# EAGLE design Adafruit PCF8575 (EAGLE 9.6.2)
COMPANY: ADAFRUIT INDUSTRIES; DRAWN: KTOWN; REV: A
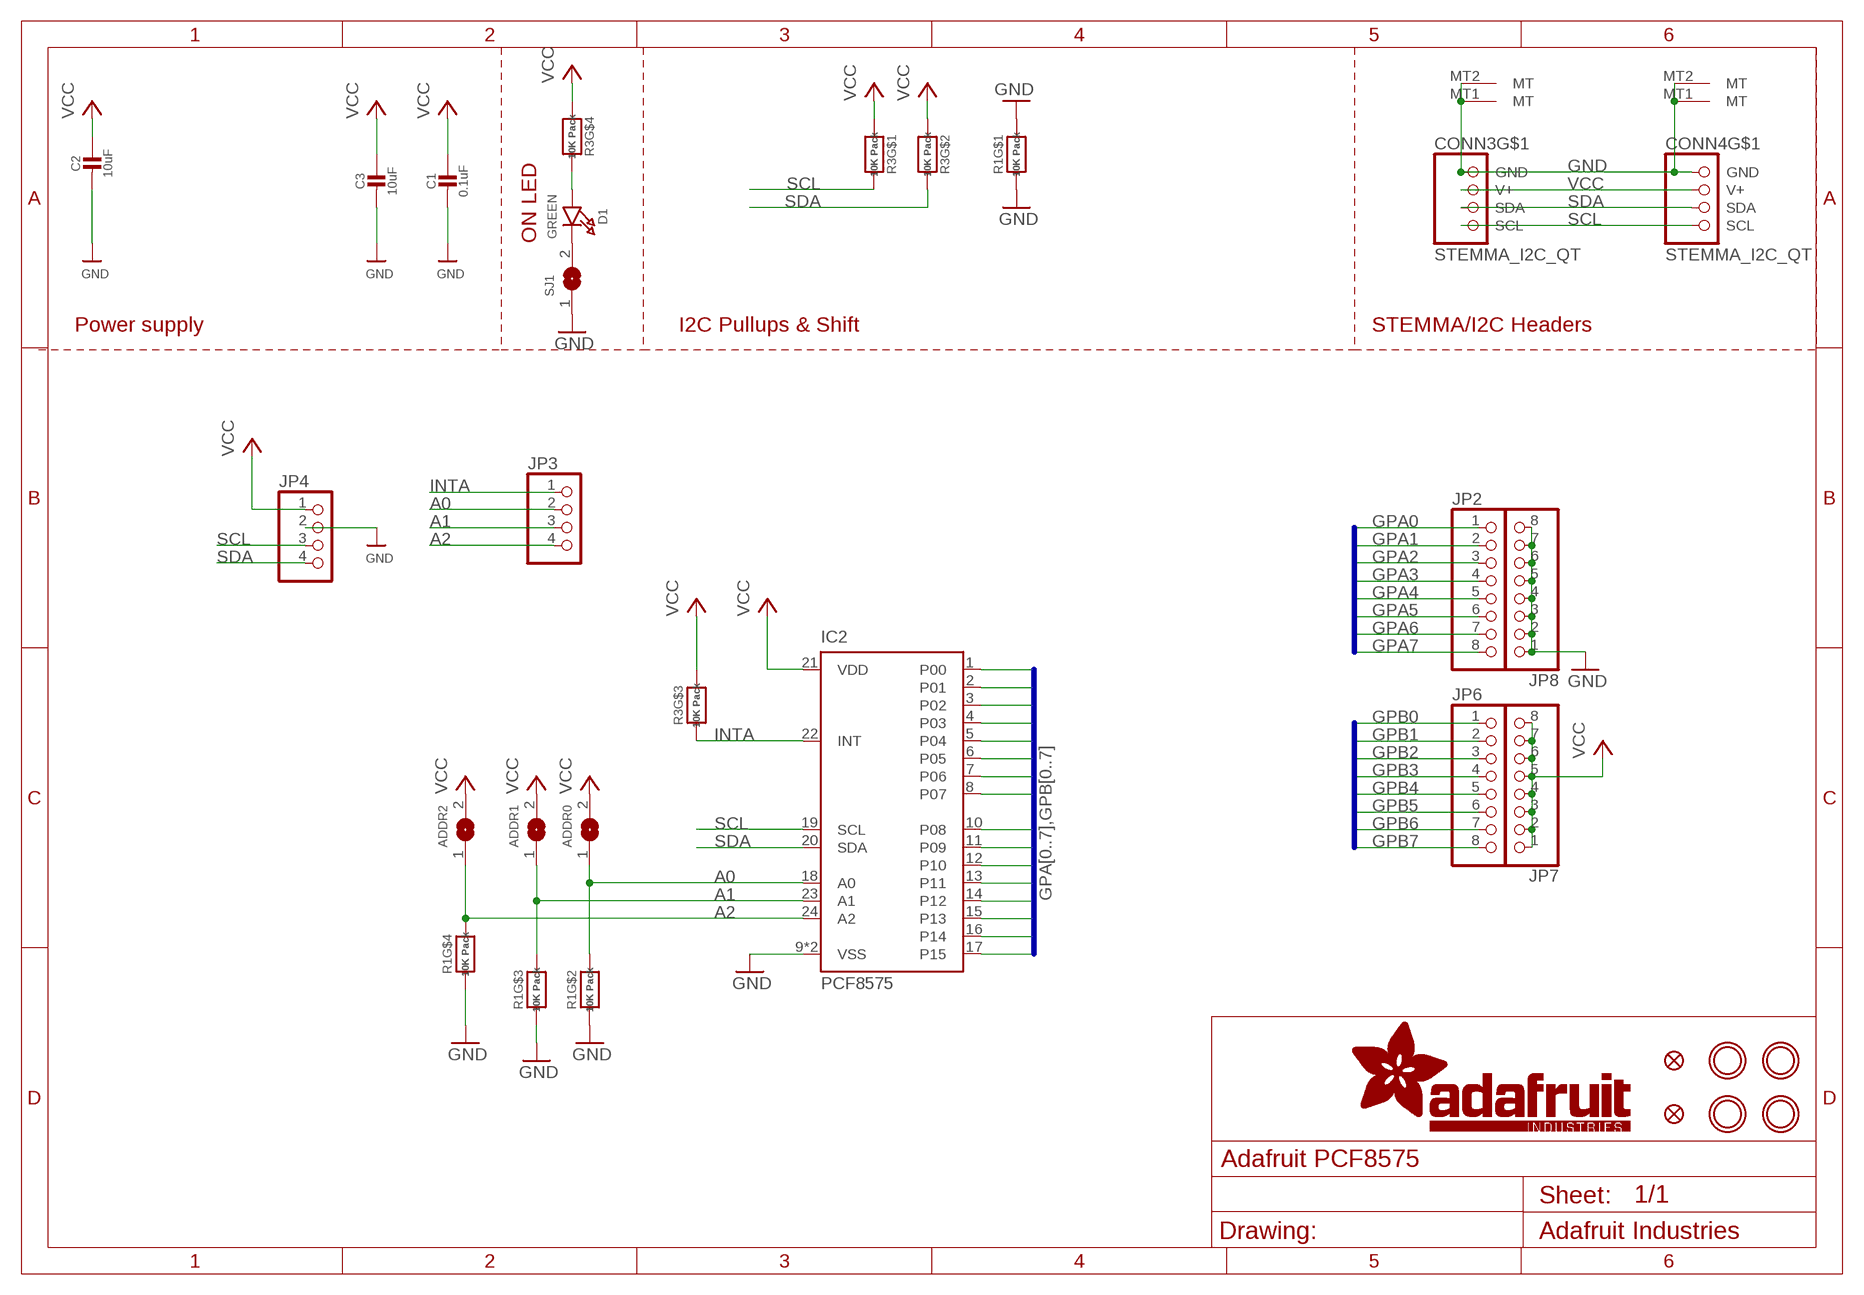
[diagram p0: schematic, sheet 1]

## Parts
ADDR0  SOLDERJUMPER  [SOLDERJUMPER_ARROW_NOPASTE]
ADDR1  SOLDERJUMPER  [SOLDERJUMPER_ARROW_NOPASTE]
ADDR2  SOLDERJUMPER  [SOLDERJUMPER_ARROW_NOPASTE]
C1  0.1uF  CAP_CERAMIC0603_NO  [0603-NO]
C2  10uF  CAP_CERAMIC0805-NOOUTLINE  [0805-NO]
C3  10uF  CAP_CERAMIC0805-NOOUTLINE  [0805-NO]
CONN3  STEMMA_I2C_QT  [JST_SH4]
CONN4  STEMMA_I2C_QT  [JST_SH4]
D1  GREEN  LED0603_NOOUTLINE  [CHIPLED_0603_NOOUTLINE]
FID3  FIDUCIAL_1MM  [FIDUCIAL_1MM]
FID4  FIDUCIAL_1MM  [FIDUCIAL_1MM]
IC2  PCF8575  [QFN24_4MM_SMSC]
JP2  HEADER-1X870MIL  [1X08_ROUND_70]
JP3  HEADER-1X4ROUND  [1X04_ROUND]
JP4  HEADER-1X4ROUND  [1X04_ROUND]
JP6  HEADER-1X870MIL  [1X08_ROUND_70]
JP7  HEADER-1X870MIL  [1X08_ROUND_70]
JP8  HEADER-1X870MIL  [1X08_ROUND_70]
R1  10K Pack  RESISTOR_4PACK  [RESPACK_4X0603]
R3  10K Pack  RESISTOR_4PACK  [RESPACK_4X0603]
SJ1  SOLDERJUMPERCLOSED  [SOLDERJUMPER_CLOSEDWIRE]
U$1  MOUNTINGHOLE2.5  [MOUNTINGHOLE_2.5_PLATED]
U$17  MOUNTINGHOLE2.5  [MOUNTINGHOLE_2.5_PLATED]
U$19  MOUNTINGHOLE2.5  [MOUNTINGHOLE_2.5_PLATED]
U$21  MOUNTINGHOLE2.5  [MOUNTINGHOLE_2.5_PLATED]

## Nets
A0: ADDR0.1 IC2.18(A0) JP3.2 R1.7
A1: ADDR1.1 IC2.23(A1) JP3.3 R1.6
A2: ADDR2.1 IC2.24(A2) JP3.4 R1.5
GND [highpower]: C1.2 C2.2 C3.2 CONN3.1(GND) CONN3.MT1(MT) CONN3.MT2(MT) CONN4.1(GND) CONN4.MT1(MT) CONN4.MT2(MT) IC2.9(VSS) IC2.THERM(VSS) JP4.2 JP8.1 JP8.2 JP8.3 JP8.4 JP8.5 JP8.6 JP8.7 JP8.8 R1.1 R1.2 R1.3 R1.4 R1.8 SJ1.1
GPA0: IC2.1(P00) JP2.1
GPA1: IC2.2(P01) JP2.2
GPA2: IC2.3(P02) JP2.3
GPA3: IC2.4(P03) JP2.4
GPA4: IC2.5(P04) JP2.5
GPA5: IC2.6(P05) JP2.6
GPA6: IC2.7(P06) JP2.7
GPA7: IC2.8(P07) JP2.8
GPB0: IC2.10(P08) JP6.1
GPB1: IC2.11(P09) JP6.2
GPB2: IC2.12(P10) JP6.3
GPB3: IC2.13(P11) JP6.4
GPB4: IC2.14(P12) JP6.5
GPB5: IC2.15(P13) JP6.6
GPB6: IC2.16(P14) JP6.7
GPB7: IC2.17(P15) JP6.8
INTA: IC2.22(INT) JP3.1 R3.3
N$1: D1.A R3.5
N$2 [highpower]: D1.C SJ1.2
SCL: CONN3.4(SCL) CONN4.4(SCL) IC2.19(SCL) JP4.3 R3.8
SDA: CONN3.3(SDA) CONN4.3(SDA) IC2.20(SDA) JP4.4 R3.7
VCC [highpower]: ADDR0.2 ADDR1.2 ADDR2.2 C1.1 C2.1 C3.1 CONN3.2(V+) CONN4.2(V+) IC2.21(VDD) JP4.1 JP7.1 JP7.2 JP7.3 JP7.4 JP7.5 JP7.6 JP7.7 JP7.8 R3.1 R3.2 R3.4 R3.6

## Buses
GPA[0..7],GPB[0..7]

## Notes on the sheet
- ON LED
- Power supply | I2C Pullups & Shift | STEMMA/I2C Headers

## Library data of the parts
ADDR0 ADDR1 ADDR2 = microbuilder:SOLDERJUMPER: SMD Solder JUMPER Solder the two pads together to create a connection, or remove the solder to break it. REFLOW - Use this footprint for solder paste and reflow ovens. WAVE - Use this footprint for hand-soldering (larger pads). CLOSED - Has a trace between the two pads to ensure it is closed by default. The trace needs to be cut to disable the jumper, and can be closed again by creating a solder bridge between the two pads.; BOM: EXCLUDE
C1-C3 = microbuilder:CAP_CERAMIC: Ceramic Capacitors For new designs, use the packages preceded by an '_' character since they are more reliable: The following footprints should be used on most boards: _0402 - Standard footprint for regular board layouts _0603 - Standard footprint for regular board layouts _0805 - Standard footprint for regular board layouts _1206 - Standard footprint for regular board layouts For extremely tight-pitch boards where space is at a premium, the following 'micro-pitch' footprints can be used (smaller pads, no silkscreen outline, etc.): _0402MP - Micro-pitch footprint for very dense/compact boards _0603MP - Micro-pitch footprint for very dense/compact boards _0805MP - Micro-pitch footprint for very dense/compact boards _1206MP - Micro-pitch footprint for very dense/compact boards
CONN3 CONN4 = adafruit_electromech:STEMMA_I2C; LCSC: C2845363
D1 = microbuilder:LED: LED 0603 - 0603 Surface Mount Package 2mA: Green LED - Low Power (3.9mcd, 2ma, 1.7Vf) - Digikey: 475-2709-2-ND Orange LED - Low Power (9.8mcd, 2ma, 1.8Vf) - Digikey: 475-1194-2-ND Red LED - Low Power (5mcd, 2ma, 1.8Vf) - Digikey: 475-1195-2-ND Yellow LED - Low Power (7mcd, 2ma, 1.8Vf) - Digikey: 475-1196-2-ND 5mA: Blue LED - Low Power (17mcd, 5ma, 2.9Vf) - Digikey: LNJ937W8CRACT-ND 0805 - 0805 Surface Mount Package 2mA: Red LED (8.8mcd, 2mA, 1.8Vf, Clear) - Low Power [Digikey: 475-2510-1-ND] Green LED (5mcd, 2mA, 1.8Vf, Clear) - Low Power [Digikey: 475-2730-1-ND] Yellow LED (11.3mcd, 2mA, 1.8Vf, Clear) - Low Power [Digikey: 475-2555-1-ND] 20mA: Red LED (104mcd, 20mA, Diffused) - LS R976 [Digikey: 475-1278-6-ND] Red LED (12mcd, 20mA, 2.0Vf, Clear) - APT2012EC [Digikey: 754-1128-1-ND] Green LED (15mcd, 20mA, 2.2Vf, Clear) - APT2012GC [Digikey: 754-1131-1-ND] Orange LED (160mcd, 20mA, 2.1Vf, Clear) - APT2012SECK [Digikey: 754-1130-1-ND] 1206 - 1206 Surface Mount Package Green LED (26mcd, 20mA, Diffused) - LG N971 [Digikey: 475-1407-6-ND] Red LED (15mcd, 20mA, Diffused) - LH N974 [Digikey: 475-1416-6-ND] Cree - Cree High-Power Surface Mount LEDs XPEBWT-L1-0000-00D50 - White 111lm 350mA 2.9Vf 6200K 110° XTEAWT-00-0000-00000LEE3 - White 114lm 350mA 2.85Vf 5000K 115° Everlight - Everlight 45-21 Series Surface Mount LEDs 45-21/QK2C-B2832AC2CB2/2T - Warm White 2000mcd 20mA 3.25Vf 3050K 120° 45-21/LK2C-B38452C4CB2/2T - Nuetral White 2000mcd 20mA 3.25Vf 4150K 120° 45-21/LK2C-B50634C6CB2/2T - Cold White 2200mcd 20mA 3.25Vf 5650K 120° PLCC2 Reverse Mount LS T77K-J1L2-1-0-2-R18-Z - Red 11.25mcd 2mA 1.8Vf 630nm 120° LO T77K-L1M2-24-Z - Orange 19.6mcd 2mA 1.8Vf 606nm 120° LY T77K-K2M1-26-Z - Yellow 15.7mcd 2mA 1.8Vf 587nm 120°; ROT: 270
FID3 FID4 = microbuilder:FIDUCIAL: Fiducial Alignment Points Various fiducial points for machine vision alignment.; BOM: EXCLUDE
IC2 = microbuilder:PCF8575
JP2 JP6-JP8 = microbuilder:HEADER-1X8: PIN HEADER
JP3 JP4 = microbuilder:HEADER-1X4: PIN HEADER
R1 R3 = microbuilder:RESISTOR_4PACK: Resistor Packs (4 resistors) 4 x 0603 10K 1/16W - Digikey: YC164J-10KCT-ND
SJ1 = microbuilder:SOLDERJUMPER: SMD Solder JUMPER Solder the two pads together to create a connection, or remove the solder to break it. REFLOW - Use this footprint for solder paste and reflow ovens. WAVE - Use this footprint for hand-soldering (larger pads). CLOSED - Has a trace between the two pads to ensure it is closed by default. The trace needs to be cut to disable the jumper, and can be closed again by creating a solder bridge between the two pads.
U$1 U$17 U$19 U$21 = adafruit_electromech:MOUNTINGHOLE: Mounting Hole For #2 screws (0.086"/2.18mm width, 0.094"/2.4mm hole) use 2.5mm; BOM: EXCLUDE

## Net classes
1 highpower: width 0.305 mm, drill 0.483 mm
2 lowpower: width 0.254 mm, drill 0.483 mm

## Board
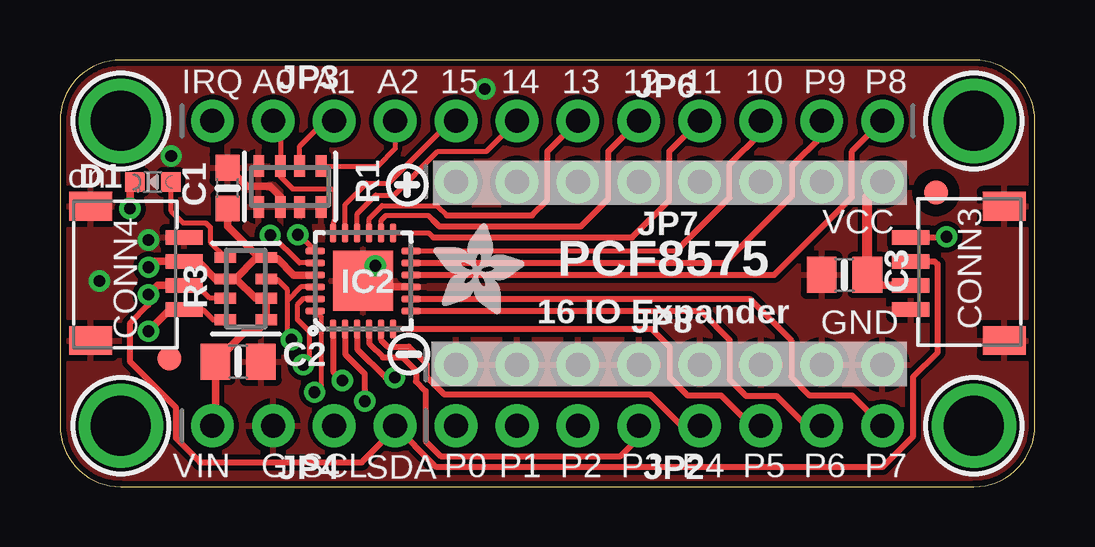
[diagram p1: board, top side]
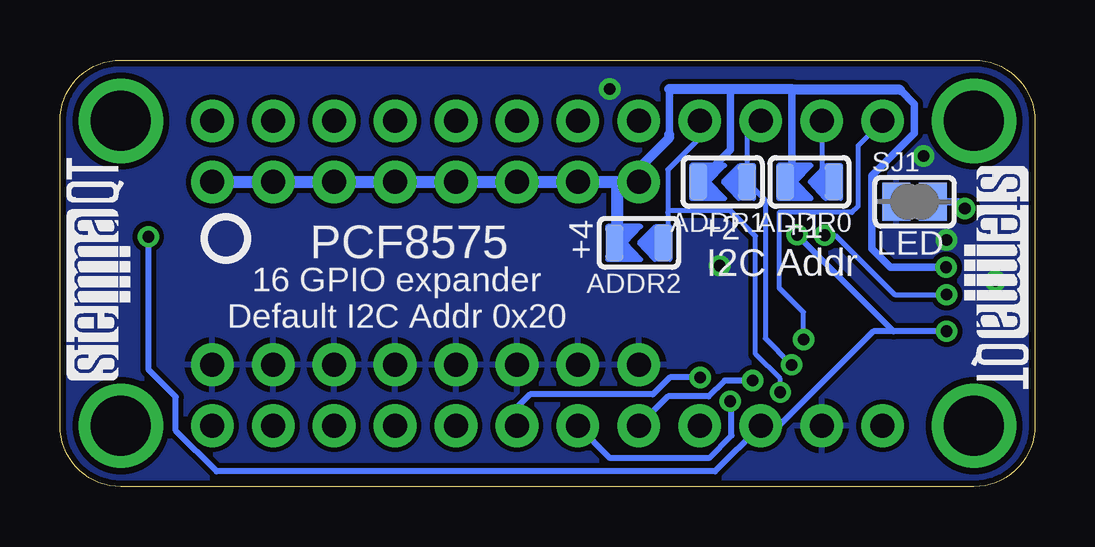
[diagram p2: board, bottom side, seen from below]

Size 40.64 x 17.78 mm. Coordinates in mm from the lower left corner, seen from the top.
Outline: 0,15.24 0,2.54 arc90 2.54,0 38.1,0 arc90 40.64,2.54 40.64,15.24 arc90 38.1,17.78 2.54,17.78 arc90 0,15.24
Copper layers (1*16): Top 0.035mm / dielectric 1.5mm / Bottom 0.035mm
Design rules "adafruit *": minimum track width 8mil, minimum drill 15.5mil, track to track 8mil, track to pad 8mil, pad to pad 8mil, via to via 8mil, smd to smd 8mil, copper to edge 10mil, drill to drill 8mil, minimum pad ring 10mil, minimum via ring 8mil, stop-mask expansion 2mil, vias tented up to drill 20mil, thermal gap 10mil

### Footprints (pad centres in the part's own frame; a part is rotated, then mirrored left to right if it is on the bottom)
SOLDERJUMPER_ARROW_NOPASTE = smd 0.762 x 1.524: 1 -1.016,0; 2 1.016,0
0603-NO = smd 1.075 x 1: 1 -0.85,0; 2 0.85,0
0805-NO = smd 1.24 x 1.5: 1 -0.95,0; 2 0.95,0
JST_SH4 = smd 0.6 x 1.55: 1 -1.5,2.006; 2 -0.5,2.006; 3 0.5,2.006; 4 1.5,2.006 | smd 1.2 x 1.8: MT1 -2.8,-1.894; MT2 2.8,-1.894
CHIPLED_0603_NOOUTLINE = smd 0.8 x 0.8: A 0,-0.75; C 0,0.75
FIDUCIAL_1MM = smd 1 x 1: 1 0,0
QFN24_4MM_SMSC = smd 0.8 x 0.28: 1 -2,1.25; 2 -2,0.75; 3 -2,0.25; 4 -2,-0.25; 5 -2,-0.75; 6 -2,-1.25; 13 2,-1.25; 14 2,-0.75; 15 2,-0.25; 16 2,0.25; 17 2,0.75; 18 2,1.25 | smd 0.28 x 0.8: 7 -1.25,-2; 8 -0.75,-2; 9 -0.25,-2; 10 0.25,-2; 11 0.75,-2; 12 1.25,-2; 19 1.25,2; 20 0.75,2; 21 0.25,2; 22 -0.25,2; 23 -0.75,2; 24 -1.25,2 | smd 2.5 x 2.5: THERM 0,0
1X08_ROUND_70 = drill 1 pad 1.778: 1 -8.89,0; 2 -6.35,0; 3 -3.81,0; 4 -1.27,0; 5 1.27,0; 6 3.81,0; 7 6.35,0; 8 8.89,0
1X04_ROUND = drill 1 pad 1.778: 1 -3.81,0; 2 -1.27,0; 3 1.27,0; 4 3.81,0
RESPACK_4X0603 = smd 0.45 x 0.9: 1 -1.3,-0.85; 2 -0.4,-0.85; 3 0.4,-0.85; 4 1.3,-0.85; 5 1.3,0.85; 6 0.4,0.85; 7 -0.4,0.85; 8 -1.3,0.85
SOLDERJUMPER_CLOSEDWIRE = smd 1.168 x 1.6: 1 -0.762,0; 2 0.762,0 | smd 0.635 x 0.203: WIRE 0,0
MOUNTINGHOLE_2.5_PLATED = drill 2.5 pad 3.2: P$1 0,0

### Placement (x,y rotation side)
ADDR0  9.4,12.7 180 bottom
ADDR1  13.02,12.7 180 bottom
ADDR2  16.51,10.16 180 bottom
C1  6.99,12.45 90 top
C2  7.43,5.21 0 top
C3  32.7,8.83 180 top
CONN3  37.47,8.89 90 top
CONN4  3.17,8.89 270 top
D1  3.87,12.7 90 top
FID3  4.57,5.33 0 top
FID4  36.51,12.26 0 top
IC2  12.64,8.57 90 top
JP2  25.4,2.54 0 top
JP3  10.16,15.24 0 top
JP4  10.16,2.54 0 top
JP6  25.4,15.24 180 top
JP7  25.4,12.7 0 top
JP8  25.4,5.08 0 top
R1  9.59,12.51 0 top
R3  7.75,8.26 90 top
SJ1  5.02,11.87 0 bottom
U$1  2.54,15.24 0 top
U$2  [SYMBOL_PLUS]  14.48,12.57 0 top
U$3  [SYMBOL_MINUS]  14.54,5.52 0 top
U$17  38.1,15.24 0 top
U$19  2.54,2.54 0 top
U$21  38.1,2.54 0 top
U$22  [ADAFRUIT_3.5MM]  15.56,7.18 0 top
U$25  [PCBFEAT-REV-040]  33.72,10.35 0 bottom
U$30  [STEMMAQT]  37.72,4.45 90 bottom
U$31  [STEMMAQT]  2.92,13.34 270 bottom

### Tracks (layer width: path | path; a pad name or v marks a point on that pad's centre or on a via)
A0
  Top 0.203: JP3.2 9.19,14.94 R1.7 9.19,12.92 9.7,12.41 11.34,12.41 11.45,12.3 11.45,11.08 11.39,11.02 IC2.18
  Bottom 0.203: JP3.2 8.89,13.21 ADDR0.1
A1  (via drill 0.48)
  Top 0.203: R1.6 9.99,14.18 11.05,15.24 JP3.3 | v10.14,5.08 10.39,5.33 10.39,6.48 9.89,6.99 9.89,7.58 10.13,7.82 IC2.23
  Bottom 0.203: JP3.3 12,14.67 ADDR1.1 11.24,11.94 11.24,6.18 v10.14,5.08
A2  (via drill 0.48)
  Top 0.203: IC2.24 10.89,7.07 10.89,4.22 v10.61,3.94 | JP3.4 13.97,14.1 13.23,13.36 R1.5
  Bottom 0.203: JP3.4 13.97,14.54 15.3,13.21 15.3,11.43 | ADDR2.1 15.49,10.67 15.3,10.86 15.3,11.43 | 15.3,11.43 15.24,11.49 12.7,11.49 11.65,10.44 11.65,5.53 10.61,4.49 v10.61,3.94
GND  (via drill 0.48)
  Top 0.305: IC2.9 12.89,8.32 IC2.THERM | R1.2 9.19,12.08 8.76,12.51 7.77,12.51 C1.2
  other vias: 4.64,13.78 3.68,10.29 17.72,16.57 13.14,9.21 1.65,8.57
  pour Top: 0,17.78 40.64,17.78 40.64,0 0,0
  pour Bottom: 0,17.78 40.64,17.78 40.64,0 0,0
GPA0  (via drill 0.48)
  Top 0.254: IC2.1 11.39,4.8 v11.77,4.42
  Bottom 0.254: v11.77,4.42 12.94,4.42 13.6,3.76 15.29,3.76 JP2.1
GPA1  (via drill 0.48)
  Top 0.254: IC2.2 11.89,5.52 12.71,4.7 v12.71,3.56
  Bottom 0.254: v12.71,3.56 12.65,3.5 12.65,2.14 13.59,1.2 17.71,1.2 JP2.2
GPA2  (via drill 0.48)
  Top 0.254: IC2.3 12.39,5.74 13.57,4.55 v13.95,4.55
  Bottom 0.254: JP2.3 21.59,3.3 21.04,3.85 15.93,3.85 15.22,4.55 v13.95,4.55
GPA3
  Top 0.254: JP2.4 24.13,2.03 23.37,1.27 15.87,1.27 15.24,1.9 15.24,3.98 14.83,4.39 14.83,4.83 14.28,5.38 13.46,5.38 12.89,5.96 IC2.4
GPA4
  Top 0.254: JP2.5 25.91,2.54 24.6,3.85 16.02,3.85 15.29,4.58 15.29,5.09 14.54,5.84 13.65,5.84 13.39,6.11 IC2.5
GPA5
  Top 0.254: JP2.6 28.83,2.54 27.56,3.81 26.16,3.81 25.43,4.55 25.43,5.82 24.8,6.45 24.68,6.56 24.67,6.57 IC2.6
GPA6
  Top 0.254: JP2.7 31.11,2.54 29.87,3.79 28.6,3.79 27.91,4.47 27.91,6.12 26.71,7.32 IC2.7
GPA7
  Top 0.254: JP2.8 33.02,3.81 31.24,3.81 30.48,4.57 30.48,6.1 28.75,7.82 IC2.8
GPB0
  Top 0.254: JP6.1 33.02,13.97 33.02,12.06 29.78,8.82 IC2.10
GPB1
  Top 0.254: JP6.2 31.75,14.61 30.52,13.37 30.52,12.12 27.73,9.32 IC2.11
GPB2
  Top 0.203: IC2.12 25.7,9.82
  Top 0.254: 25.7,9.82 25.91,10.03 27.91,12.04 27.91,13.44 29.21,14.73 JP6.3
GPB3
  Top 0.203: IC2.13 15.37,10.57 15.55,10.39
  Top 0.254: 15.55,10.39 23.85,10.39 25.4,11.94 25.4,13.97 JP6.4
GPB4
  Top 0.203: IC2.14 13.39,11.1 13.59,11.3 15.35,11.3 15.55,11.1
  Top 0.254: JP6.5 22.86,13.97 22.86,11.99 21.72,10.85 15.81,10.85 15.55,11.1
GPB5
  Top 0.203: IC2.15 12.89,11.18 13.42,11.71 15.72,11.71 16.13,11.3
  Top 0.254: 16.13,11.3 19.68,11.3 20.32,11.94 20.32,13.97 JP6.6
GPB6
  Top 0.203: IC2.16 12.39,11.37 13.16,12.15 13.93,12.15 15.75,13.97 17.78,13.97 JP6.7
GPB7
  Top 0.203: IC2.17 11.89,11.76 12.78,12.65 13.7,12.65 16.29,15.24 JP6.8
INTA  (via drill 0.48)
  Top 0.203: 9.48,7.77 9.48,6.29 v9.65,6.13 | IC2.22 10.03,8.32 9.48,7.77 | R3.3 8.61,8.64 9.05,8.64 9.48,8.2 9.48,7.77
  Bottom 0.203: v9.65,6.13 9.65,7.27 10.66,8.29 10.66,11.43 7.62,11.43 7.38,11.67 7.38,14.21 JP3.1
N$1
  Top 0.203: R3.5 6.26,10.19 6.26,10.82 6.08,10.99 5.13,10.99 4.62,11.51 D1.A
N$2  (via drill 0.48)
  Top 0.305: v2.92,11.59 2.92,12.7 D1.C
  Bottom 0.305: SJ1.2 3.21,11.87 v2.92,11.59
SCL  (via drill 0.48)
  Top 0.203: CONN4.4 5.95,7.39 6.38,6.96 R3.8 | IC2.19 9.96,10.5 v9.91,10.5
  Top 0.254: CONN3.4 36.93,10.39 v36.96,10.41
  Top 0.305: CONN4.4 4.6,7.39 v3.68,6.48
  Bottom 0.254: v36.96,10.41 36.96,4.89 35.81,3.75 35.81,2.34 34.11,0.64 13.34,0.64 JP4.3 10.67,2.54 6.73,6.48 v3.68,6.48 5.89,6.48 v9.91,10.5
SDA  (via drill 0.48)
  Top 0.203: CONN4.3 5.71,8.39 6.22,7.87 6.88,7.87 R3.7 | IC2.20 9.98,9.32 8.83,10.48 v8.76,10.48
  Top 0.254: 14.03,2.48 14.78,1.73 14.78,1.71 15.68,0.81 34.29,0.81 35.56,2.09 35.56,4.57 36.58,5.59 36.58,9.27 36.46,9.39 CONN3.3 | 14.03,2.48 JP4.4 | v3.68,8 3.68,7.57 2.91,6.8 2.91,5.22 4.83,3.3 4.83,2.03 5.84,1.02 12.57,1.02 14.03,2.48
  Top 0.305: CONN4.3 4.07,8.39 v3.68,8
  Bottom 0.203: v8.76,10.48 8.32,10.48 5.84,8 v3.68,8
VCC  (via drill 0.48)
  Top 0.305: C3.1 34.09,8.39 CONN3.2 | v3.7,9.14 3.7,9.28 3.8,9.39 CONN4.2 5.76,9.39 6.49,8.65 R3.6 | IC2.21 9.74,8.82 9.07,9.49 8.66,9.49 R3.4 8.26,9.55 | R3.6 7.35,8.65 8.15,7.86 R3.2 R3.1 8.6,6.88 8.19,6.48 7.75,6.48 C2.1 6.48,2.67 JP4.1 | R3.6 7.29,8.65 8.19,9.55 8.26,9.55 | C1.1 6.99,10.86 8.26,9.59 8.26,9.55
  Top 0.406: C3.1 33.65,12.06 JP7.8
  Bottom 0.305: v3.7,9.14 6.03,9.14 6.79,9.91 6.79,12.95 5.02,14.73 5.02,15.94 5.61,16.54 | 15.24,14.68 15.24,16.57 | ADDR2.2 17.4,10.29 | ADDR1.2 12.7,14.03 12.7,16.57 | ADDR0.2 10.13,12.98 10.13,16.51 | 10.13,16.51 10.13,16.57 | 10.11,16.54 10.13,16.51
  Bottom 0.406: 10.13,16.57 12.7,16.57 15.24,16.57 | 17.4,12.7 JP7.1 16.51,13.27 15.24,14.54 15.24,14.68 | 5.61,16.54 10.11,16.54
  Bottom 0.508: JP7.8 JP7.7 JP7.6 JP7.5 JP7.4 JP7.3 JP7.2 17.4,12.7 17.4,10.29

### Text on the board
tPlace: IRQ | A0 | A1 | A2 | 15 | 14 | 13 | 12 | 11 | 10 | P9 | P8 | on | VCC | PCF8575 | 16 IO Expander | GND | VIN | G | SCL | SDA | P0 | P1 | P2 | P3 | P4 | P5 | P6 | P7
bPlace: +1 | +2 | LED | +4 | PCF8575 | I2C Addr | 16 GPIO expander / Default I2C Addr 0x20